# EAGLE schematic 2021-02-20 RJ11-6-PIN Breakout Ordered (EAGLE 9.6.2)
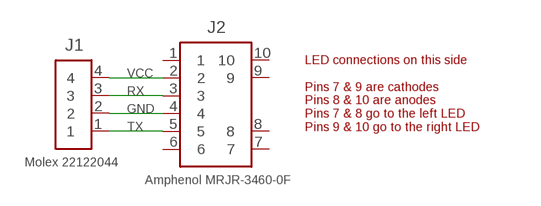
[diagram p0: schematic, sheet 1]

## Parts
J1  Molex 22122044  PINHD-1X4RA-MOLEX-22122044  [1X04RA-MOLEX-22122044]
J2  Amphenol MRJR-3460-0F  RJ11-6-PIN  [RJ11-6-PIN]

## Nets
GND: J1.2 J2.4
RX: J1.3 J2.3
TX: J1.1 J2.5
VCC: J1.4 J2.2
Unconnected: J2.1 J2.6 J2.7 J2.8 J2.9 J2.10

## Notes on the sheet
- LED connections on this side
  
  Pins 7 & 9 are cathodes
  Pins 8 & 10 are anodes
  Pins 7 & 8 go to the left LED
  Pins 9 & 10 go to the right LED

## Library data of the parts
J1 = AUmlib:PINHD-1X4RA-MOLEX-22122044
J2 = AUmlib:RJ11-6-PIN